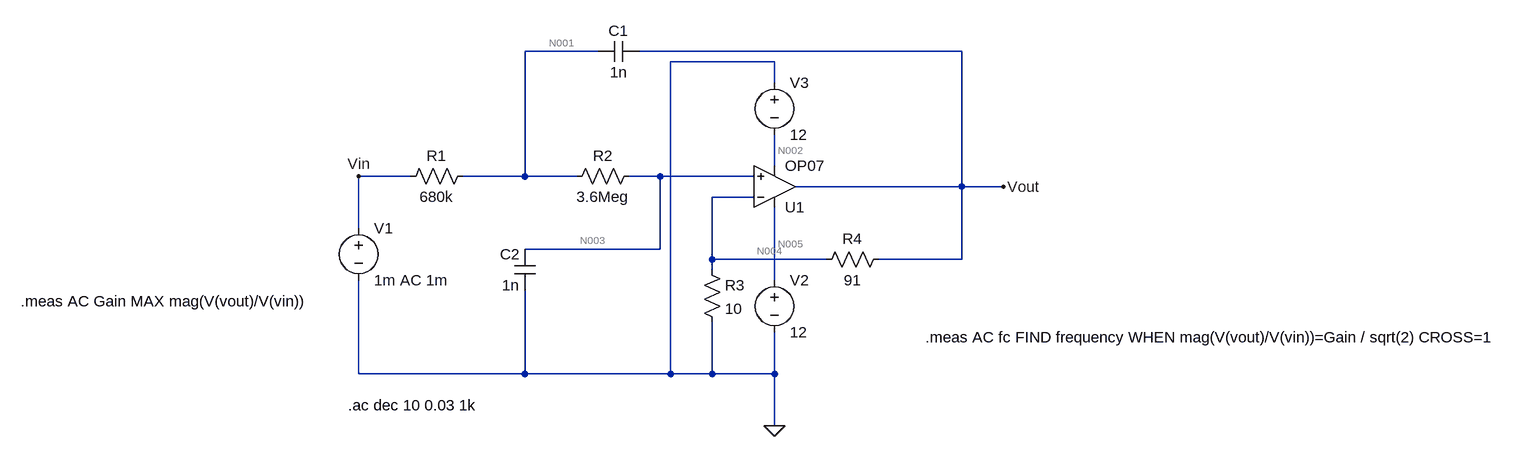
[diagram p0: schematic LF.asc]
LF.asc, the LTspice schematic file:
Version 4.1
SHEET 1 1864 680
WIRE 352 -96 240 -96
WIRE 912 -96 416 -96
WIRE 624 -80 464 -80
WIRE 624 -48 624 -80
WIRE 624 80 624 32
WIRE 64 96 -16 96
WIRE 240 96 240 -96
WIRE 240 96 144 96
WIRE 320 96 240 96
WIRE 448 96 400 96
WIRE 592 96 448 96
WIRE 912 112 912 -96
WIRE 912 112 656 112
WIRE 976 112 912 112
WIRE 592 128 528 128
WIRE -16 176 -16 96
WIRE 448 208 448 96
WIRE 448 208 240 208
WIRE 528 224 528 128
WIRE 704 224 528 224
WIRE 912 224 912 112
WIRE 912 224 784 224
WIRE 528 240 528 224
WIRE 624 256 624 144
WIRE -16 400 -16 256
WIRE 240 400 240 272
WIRE 240 400 -16 400
WIRE 464 400 464 -80
WIRE 464 400 240 400
WIRE 528 400 528 320
WIRE 528 400 464 400
WIRE 624 400 624 336
WIRE 624 400 528 400
WIRE 624 480 624 400
FLAG 624 480 0
FLAG -16 96 Vin
FLAG 976 112 Vout
SYMBOL res 160 80 R90
WINDOW 0 0 56 VBottom 2
WINDOW 3 32 56 VTop 2
SYMATTR InstName R1
SYMATTR Value 680k
SYMBOL res 416 80 R90
WINDOW 0 0 56 VBottom 2
WINDOW 3 32 56 VTop 2
SYMATTR InstName R2
SYMATTR Value 3.6Meg
SYMBOL res 512 224 R0
SYMATTR InstName R3
SYMATTR Value 10
SYMBOL cap 416 -112 R90
WINDOW 0 0 32 VBottom 2
WINDOW 3 32 32 VTop 2
SYMATTR InstName C1
SYMATTR Value 1n
SYMBOL cap 256 272 R180
WINDOW 0 24 56 Left 2
WINDOW 3 24 8 Left 2
SYMATTR InstName C2
SYMATTR Value 1n
SYMBOL res 800 208 R90
WINDOW 0 0 56 VBottom 2
WINDOW 3 32 56 VTop 2
SYMATTR InstName R4
SYMATTR Value 91
SYMBOL OpAmps\\OP07 624 176 M180
SYMATTR InstName U1
SYMBOL voltage -16 160 R0
SYMATTR InstName V1
SYMATTR Value 1m AC 1m
SYMBOL voltage 624 240 R0
SYMATTR InstName V2
SYMATTR Value 12
SYMBOL voltage 624 -64 R0
SYMATTR InstName V3
SYMATTR Value 12
TEXT -32 448 Left 2 !.ac dec 10 0.03 1k
TEXT -536 288 Left 2 !.meas AC Gain MAX mag(V(vout)/V(vin))
TEXT 856 344 Left 2 !.meas AC fc FIND frequency WHEN mag(V(vout)/V(vin))=Gain / sqrt(2) CROSS=1

The netlist it stands for:
* LF.asc
R1 N001 Vin 680k
R2 N003 N001 3.6Meg
R3 N004 0 10
C1 Vout N001 1n
C2 0 N003 1n
R4 Vout N004 91
X§U1 N003 N004 N005 N002 Vout LT1001  ; OP07, pins In+ In- V+ V- OUT
V1 Vin 0 1m AC 1m
V2 N005 0 12
V3 0 N002 12
.ac dec 10 0.03 1k
.meas AC Gain MAX mag(V(vout)/V(vin))
.meas AC fc FIND frequency WHEN mag(V(vout)/V(vin))=Gain / sqrt(2) CROSS=1
.lib LTC.lib
.backanno
.end

* Results of the author's LTspice run, read from the files saved beside the schematic
* Operating Point, zero values left out:
*   V(n001) = 1 mV
*   V(n002) = -12 V
*   V(n003) = 1 mV
*   V(n004) = 1 mV
*   V(n005) = 12 V
*   V(vin) = 1 mV
*   V(vout) = 10.1 mV
*   I(R3) = 100 µA
*   I(R4) = 100 µA
*   I(V2) = -2.3 mA
*   I(V3) = -2.2 mA
*   Ix(u1:3) = 2.3 mA
*   Ix(u1:4) = -2.2 mA
*   Ix(u1:5) = -100 µA
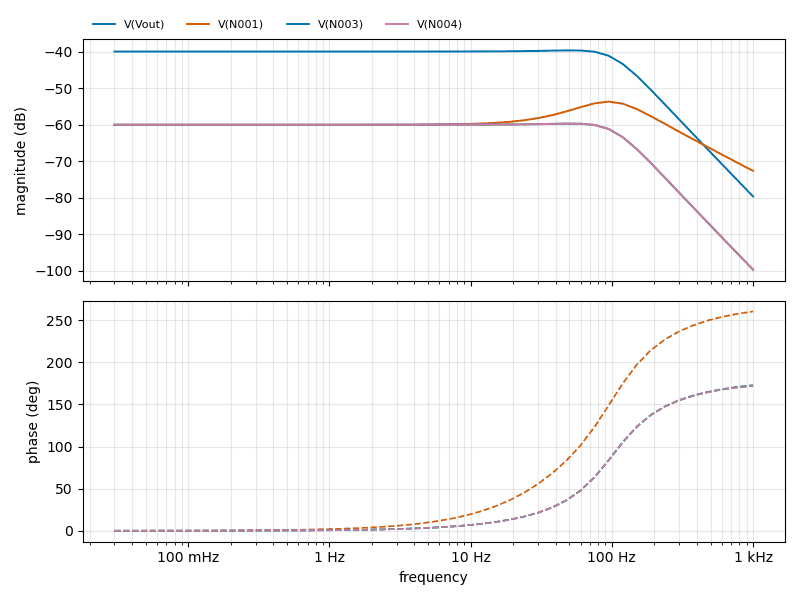
[diagram p1: AC Analysis of LF.asc, plotted from the saved traces]
* AC Analysis, 1 run:
*   V(Vout): -39.91 dB at 30 mHz, -79.66 dB at 1 kHz, peak -39.61 dB at 47.55 Hz, 3 dB below the peak at 111.1 Hz
*   V(N001): -60.00 dB at 30 mHz, -72.64 dB at 1 kHz, peak -53.65 dB at 94.87 Hz, 3 dB below the peak at 44.28 Hz and 168.3 Hz
*   V(N003): -60.00 dB at 30 mHz, -99.75 dB at 1 kHz, peak -59.69 dB at 47.55 Hz, 3 dB below the peak at 111.1 Hz
*   V(N004): -60.00 dB at 30 mHz, -99.75 dB at 1 kHz, peak -59.69 dB at 47.55 Hz, 3 dB below the peak at 111.1 Hz
* From the log:
*   gain: MAX(mag(V(vout)/V(vin)))=(20.3949583315dB,0°) FROM 0.03 TO 1000
*   fc: frequency=(40.8978621901dB,0°) at 110.890185381